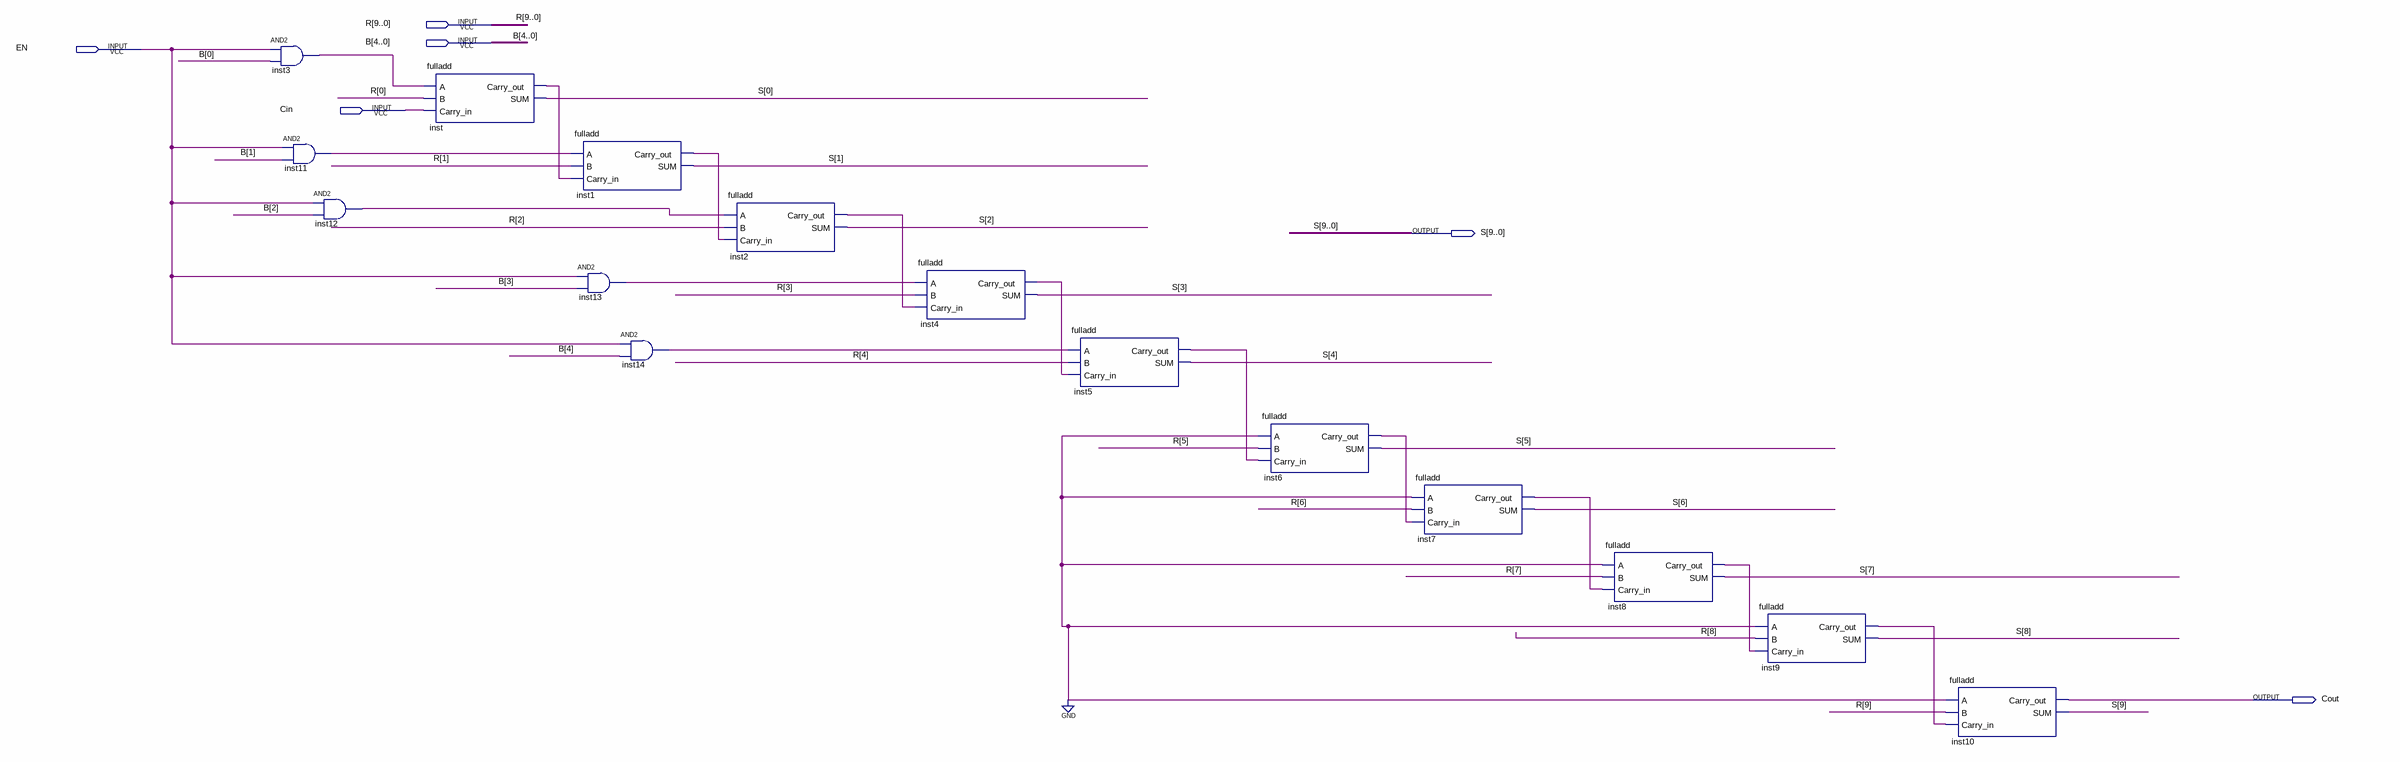
[diagram p0: schematic sheet]
// Quartus schematic 10-bitadder2.bdf as structural Verilog: 15 symbols, 6 pins
module \10-bitadder2  (
  input  [9:0] R,
  input  [4:0] B,
  input  EN,
  input  Cin,
  output [9:0] S,
  output Cout
);

  wire inst1_carry_out, inst2_carry_out, inst3_out, inst4_carry_out, inst5_carry_out, inst6_carry_out,
       inst7_carry_out, inst8_carry_out, inst9_carry_out, inst11_out, inst12_out, inst13_out, inst14_out,
       inst_carry_out;

  and inst3 (inst3_out, EN, B[0]);
  and inst11 (inst11_out, EN, B[1]);
  and inst12 (inst12_out, EN, B[2]);
  fulladd inst (.A(inst3_out), .B(R[0]), .Carry_in(Cin), .Carry_out(inst_carry_out), .SUM(S[0]));
  fulladd inst1 (.A(inst11_out), .B(R[1]), .Carry_in(inst_carry_out), .Carry_out(inst1_carry_out), .SUM(S[1]));
  and inst13 (inst13_out, EN, B[3]);
  and inst14 (inst14_out, EN, B[4]);
  fulladd inst2 (.A(inst12_out), .B(R[2]), .Carry_in(inst1_carry_out), .Carry_out(inst2_carry_out), .SUM(S[2]));
  fulladd inst4 (.A(inst13_out), .B(R[3]), .Carry_in(inst2_carry_out), .Carry_out(inst4_carry_out), .SUM(S[3]));
  fulladd inst5 (.A(inst14_out), .B(R[4]), .Carry_in(inst4_carry_out), .Carry_out(inst5_carry_out), .SUM(S[4]));
  fulladd inst6 (.A(1'b0), .B(R[5]), .Carry_in(inst5_carry_out), .Carry_out(inst6_carry_out), .SUM(S[5]));
  fulladd inst7 (.A(1'b0), .B(R[6]), .Carry_in(inst6_carry_out), .Carry_out(inst7_carry_out), .SUM(S[6]));
  fulladd inst8 (.A(1'b0), .B(R[7]), .Carry_in(inst7_carry_out), .Carry_out(inst8_carry_out), .SUM(S[7]));
  fulladd inst9 (.A(1'b0), .B(R[8]), .Carry_in(inst8_carry_out), .Carry_out(inst9_carry_out), .SUM(S[8]));
  fulladd inst10 (.A(1'b0), .B(R[9]), .Carry_in(inst9_carry_out), .Carry_out(Cout), .SUM(S[9]));
endmodule
